# Altium project Trackpad.PrjPCB
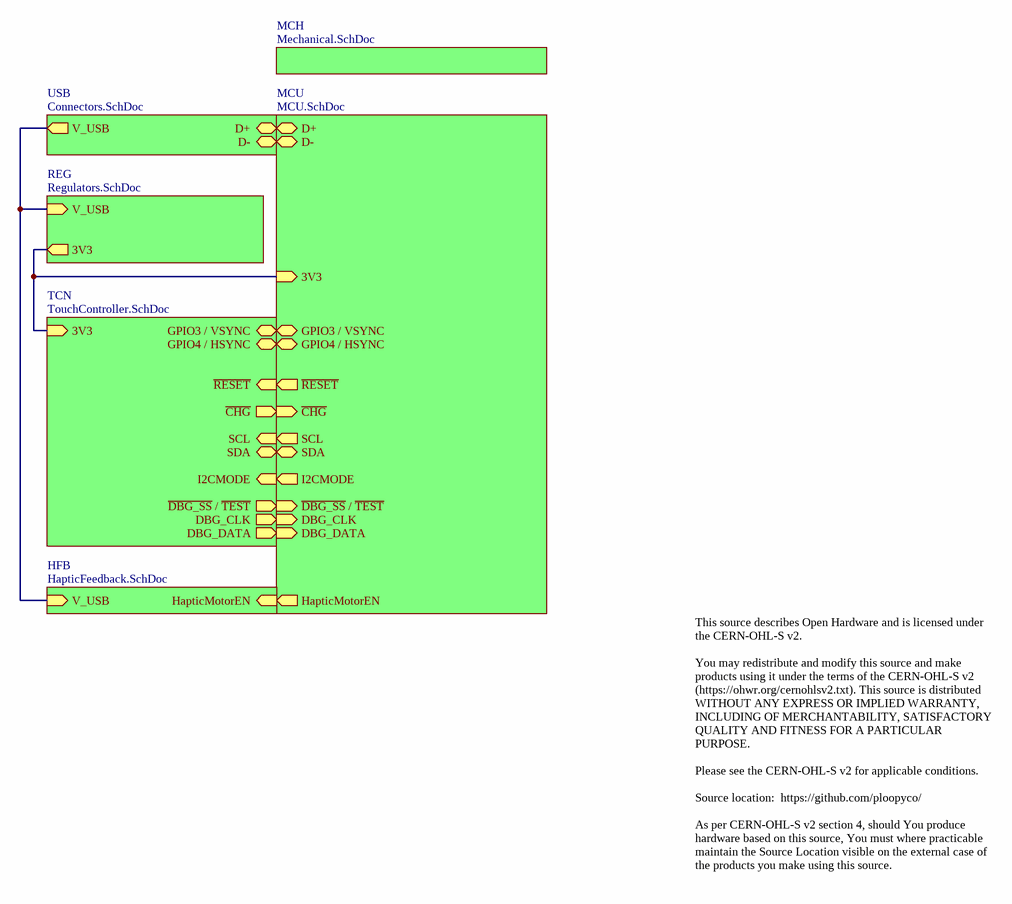
[diagram p0: Trackpad.SchDoc]
7 sheets, 124 parts. Net scope: hierarchical (ports join the sheet entries above them; power ports are global).
Board files: Trackpad.PcbDoc, TrackpadSolderStencil.PcbDoc, TrackpadPanel.PcbDoc
Sheets:
  Trackpad.SchDoc
    USB = Connectors.SchDoc
    REG = Regulators.SchDoc
    TCN = TouchController.SchDoc
    MCU = MCU.SchDoc
    MCH = Mechanical.SchDoc
    HFB = HapticFeedback.SchDoc

## Sheet Trackpad.SchDoc
size Letter; CompanyName: Ploopy Corporation; Organization: Ploopy Corporation; Address1: 137-1140 Burnhamthorpe Road W; Address2: Mississauga; Address3: Ontario; Address4: Canada L5C 0A3; DocumentNumber: 1; Revision: R2.002; SheetNumber: 1; SheetTotal: 8

### Sub-sheets
HFB = HapticFeedback.SchDoc: HapticMotorEN (in), V_USB (in)
MCH = Mechanical.SchDoc: no entries
MCU = MCU.SchDoc: D+ (bidir), D- (bidir), 3V3 (in), GPIO4 / HSYNC (bidir), GPIO3 / VSYNC (bidir), ~{RESET} (out), ~{CHG} (in), SCL (out), SDA (bidir), DBG_DATA (in), ~{DBG_SS} / ~{TEST} (in), DBG_CLK (in), I2CMODE (out), HapticMotorEN (out)
REG = Regulators.SchDoc: 3V3 (out), V_USB (in)
TCN = TouchController.SchDoc: 3V3 (in), DBG_DATA (out), GPIO4 / HSYNC (bidir), ~{RESET} (in), ~{DBG_SS} / ~{TEST} (out), DBG_CLK (out), GPIO3 / VSYNC (bidir), ~{CHG} (out), SCL (in), SDA (bidir), I2CMODE (in)
USB = Connectors.SchDoc: D+ (bidir), V_USB (out), D- (bidir)

### Nets
3V3: sheet REG/3V3, sheet TCN/3V3, sheet MCU/3V3
NetC35_2: sheet USB/V_USB, sheet REG/V_USB, sheet HFB/V_USB
NetQ1_G: sheet MCU/HapticMotorEN, sheet HFB/HapticMotorEN
NetR3_2: sheet USB/D-, sheet MCU/D-
NetR4_2: sheet USB/D+, sheet MCU/D+
NetRa1_3: sheet TCN/~{DBG_SS} / ~{TEST}, sheet MCU/~{DBG_SS} / ~{TEST}
NetRa1_4: sheet TCN/~{RESET}, sheet MCU/~{RESET}
NetRa2_1: sheet TCN/SDA, sheet MCU/SDA
NetRa2_2: sheet TCN/SCL, sheet MCU/SCL
NetRa2_3: sheet TCN/~{CHG}, sheet MCU/~{CHG}
NetU2_F7: sheet TCN/GPIO3 / VSYNC, sheet MCU/GPIO3 / VSYNC
NetU2_F8: sheet TCN/DBG_DATA, sheet MCU/DBG_DATA
NetU2_G8: sheet TCN/DBG_CLK, sheet MCU/DBG_CLK
NetU2_H6: sheet TCN/I2CMODE, sheet MCU/I2CMODE
NetU2_J8: sheet TCN/GPIO4 / HSYNC, sheet MCU/GPIO4 / HSYNC

### Notes on the sheet
- This source describes Open Hardware and is licensed under the CERN-OHL-S v2.
  You may redistribute and modify this source and make products using it under the terms of the CERN-OHL-S v2 (https://ohwr.org/cernohlsv2.txt). This source is distributed WITHOUT ANY EXPRESS OR IMPLIED WARRANTY, INCLUDING OF MERCHANTABILITY, SATISFACTORY QUALITY AND FITNESS FOR A PARTICULAR PURPOSE.
  Please see the CERN-OHL-S v2 for applicable conditions.
  Source location:  https://github.com/ploopyco/
  As per CERN-OHL-S v2 section 4, should You produce hardware based on this source, You must where practicable maintain the Source Location visible on the external case of the products you make using this source.
- Copyright Ploopy Corporation 2024
- Licensed under the CERN-OHL-S v2
- http://ohwr.org/cernohl
- Title:
- PCB:
- Version:
- Ploopy Corporation
- Mississauga ON L5C 0A3
- 137-1140 Burnhamthorpe Road W
- Date:
- Time:
- Sheet
- of
- Canada

## Sheet Connectors.SchDoc
size Letter; CompanyName: Ploopy Corporation; Organization: Ploopy Corporation; Address1: 137-1140 Burnhamthorpe Road W; Address2: Mississauga; Address3: Ontario; Address4: Canada L5C 0A3; DocumentNumber: 3; Revision: R2.002; SheetNumber: 3; SheetTotal: 8
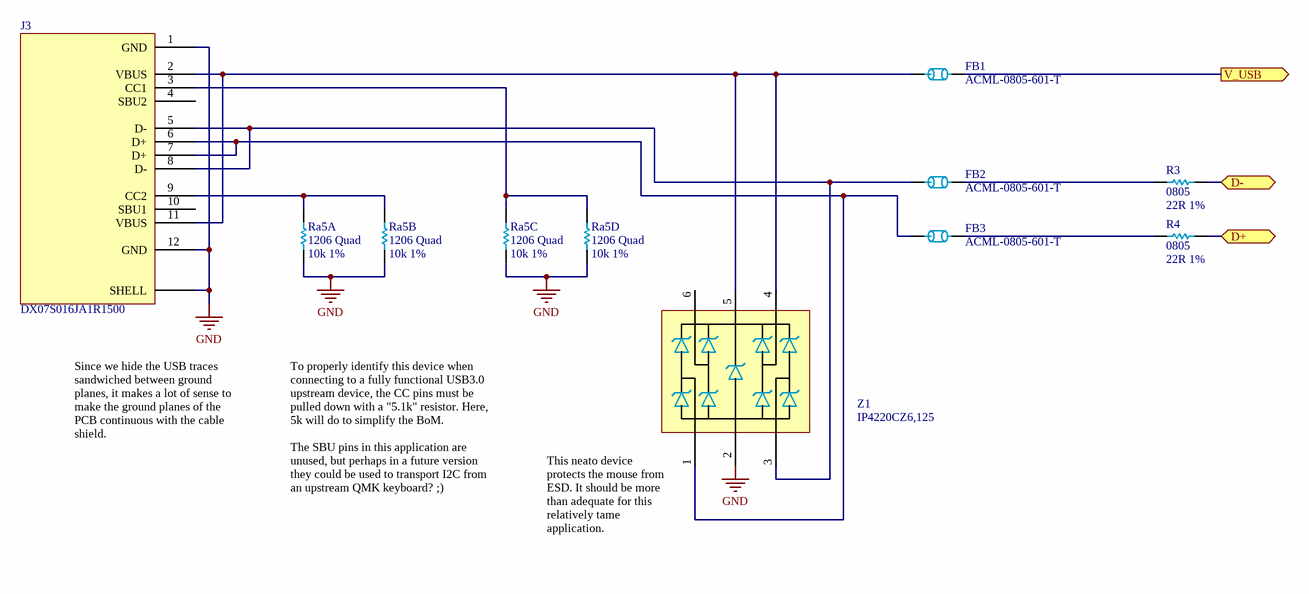
[diagram p1: Connectors.SchDoc]

### Parts
FB1  ACML-0805-601-T  [0805]
FB2  ACML-0805-601-T  [0805]
FB3  ACML-0805-601-T  [0805]
J3  DX07S016JA1R1500  [DX07S016JA1R1500]
R3  0805  value 22R 1%  [0805]
R4  0805  value 22R 1%  [0805]
Ra5  1206 Quad  value 10k 1%  [4x 10k 1% - CAC-80P320X160-8M]  (parts A,B,C,D of 4)
Z1  IP4220CZ6,125  [PESD3V3S4UD - SOT95P275X110-6N]

### Ports
D+ (bidir), D- (bidir), V_USB (out)

### Nets
GND: J3.1(GND) J3.12(GND) J3.SHELL Ra5.1 Ra5.2 Ra5.3 Ra5.4 Z1.2
NetC35_2: FB1.2 ; port V_USB
NetFB1_1: FB1.1 J3.2(VBUS) J3.11(VBUS) Z1.4 Z1.5
NetFB2_1: FB2.1 J3.5(D-) J3.8(D-) Z1.3
NetFB2_2: FB2.2 R3.1
NetFB3_1: FB3.1 J3.6(D+) J3.7(D+) Z1.1
NetFB3_2: FB3.2 R4.1
NetJ3_3: J3.3(CC1) Ra5.5 Ra5.6
NetJ3_9: J3.9(CC2) Ra5.7 Ra5.8
NetR3_2: R3.2 ; port D-
NetR4_2: R4.2 ; port D+

Not connected (* = marked no-connect by the designer): J3 4(SBU2) 10(SBU1); Z1 6

### Notes on the sheet
- Since we hide the USB traces sandwiched between ground planes, it makes a lot of sense to make the ground planes of the PCB continuous with the cable shield.
- To properly identify this device when connecting to a fully functional USB3.0 upstream device, the CC pins must be pulled down with a "5.1k" resistor. Here, 5k will do to simplify the BoM.
  The SBU pins in this application are unused, but perhaps in a future version they could be used to transport I2C from an upstream QMK keyboard? ;)
- (near Z1) This neato device protects the mouse from ESD. It should be more than adequate for this relatively tame application.
- Copyright Ploopy Corporation 2024
- Licensed under the CERN-OHL-S v2
- http://ohwr.org/cernohl
- Title:
- PCB:
- Version:
- Ploopy Corporation
- Mississauga ON L5C 0A3
- 137-1140 Burnhamthorpe Road W
- Date:
- Time:
- Sheet
- of
- Canada

### Library data of the parts
FB1-FB3 = ACML-0805-601-T: FERRITE BEAD 600 OHM 0805 1LN; PNP-Nzl: 2; PNP-dx: 0; PNP-X: 2.00; PNP-Y: 1.25; PNP-Thk: 0.55; PNP-Lv: 1; PNP-TS: 70; PNP-Type: chi; PNP-FeedType: Tape; PNP-TapeWidth: 8; PNP-dy: 0; PNP-Pt: 0; PNP-W: 0; PNP-Level: 1; PNP-Voff: 0; PNP-PlacePriority: 1; PNP-A: 0; PNP-TapeIndex: 1; PNP-da: 0; Supplier 1: Digi-Key; Supplier Part Number 1: 535-12556-1-ND
J3 = DX07S016JA1R1500: USB-C (USB TYPE-C) USB 2.0 Receptacle Connector 24 (16+8 Dummy) Position Surface Mount, Right Angle; Through Hole; Supplier 1: Digi-Key; Supplier 2: Mouser; Supplier Part Number 1: 670-DX07S016JA1R1500CT-ND; Supplier Part Number 2: 656-DX07S016JA1R1500
R3 R4 = Res 22R 1% 0805: Chip resistor; PNP-Nzl: 2; PNP-dx: 0; PNP-X: 2.00; PNP-Y: 1.25; PNP-Thk: 0.55; PNP-Lv: 1; PNP-TS: 70; PNP-Type: chi; PNP-FeedType: Tape; PNP-TapeWidth: 8; PNP-dy: 0; PNP-Pt: 0; PNP-W: 0; PNP-Level: 1; PNP-Voff: 0; PNP-PlacePriority: 1; PNP-A: 0; PNP-TapeIndex: 1; PNP-da: 0; Supplier 1: Digi-Key; Supplier 2: Arrow; Supplier Part Number 1: RMCF0805FT22R0CT-ND; Supplier Part Number 2: RMCF0805FT22R0
Ra5 = Quad Res 10k 1% 1206: Chip resistor
Z1 = IP4220CZ6,125: TVS DIODE 5.5V 6TSOP (Low capacitance, USB); PNP-Nzl: 2; PNP-dx: 0; PNP-X: 2.9; PNP-Y: 1.3; PNP-A: 270; PNP-Thk: 1; PNP-Lv: 26; PNP-TS: 90; PNP-Type: CHP; PNP-FeedType: Tape; PNP-TapeWidth: 8; PNP-PlacePriority: 3; PNP-dy: 0; PNP-Pt: 0; PNP-W: 0; PNP-Level: 1; PNP-Voff: 0; PNP-TapeIndex: 1; PNP-da: 0

## Sheet Regulators.SchDoc
size Letter; CompanyName: Ploopy Corporation; Organization: Ploopy Corporation; Address1: 137-1140 Burnhamthorpe Road W; Address2: Mississauga; Address3: Ontario; Address4: Canada L5C 0A3; DocumentNumber: 7; Revision: R2.002; SheetNumber: 7; SheetTotal: 8
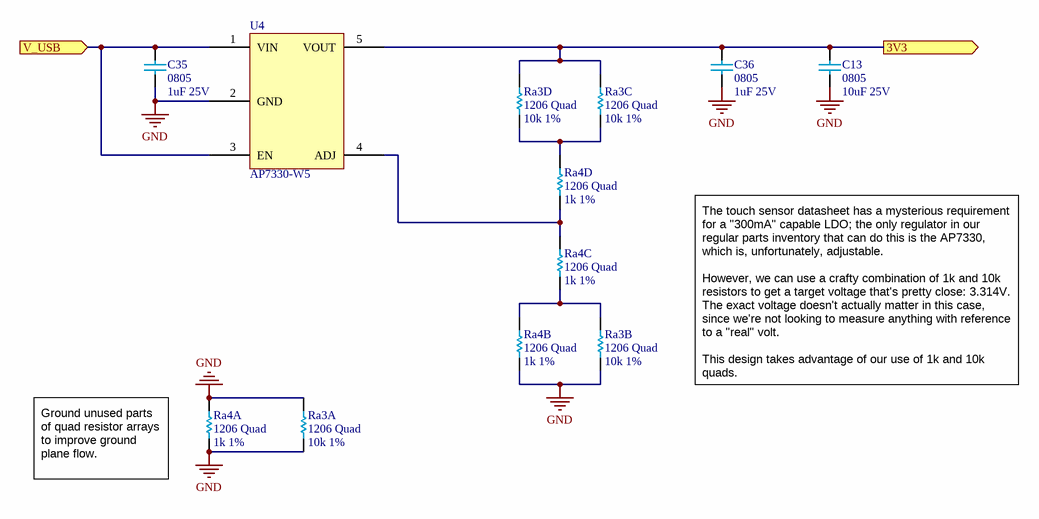
[diagram p2: Regulators.SchDoc]

### Parts
C13  0805  value 10uF 25V  [0805]
C35  0805  value 1uF 25V  [0805]
C36  0805  value 1uF 25V  [0805]
Ra3  1206 Quad  value 10k 1%  [4x 10k 1% - CAC-80P320X160-8M]  (parts A,B,C,D of 4)
Ra4  1206 Quad  value 1k 1%  [4x 1k 1% - CAC-80P320X160-8M]  (parts A,B,C,D of 4)
U4  AP7330-W5  [AP7330-W5 - SOT95P270X145-5N]

### Ports
3V3 (out), V_USB (in)

### Nets
GND: C13.1 C35.1 C36.1 Ra3.1 Ra3.2 Ra3.8 Ra4.1 Ra4.7 Ra4.8 U4.2(GND)
3V3: C13.2 C36.2 Ra3.3 Ra3.4 U4.5(VOUT) ; port 3V3
NetC35_2: C35.2 U4.1(VIN) U4.3(EN) ; port V_USB
NetRa3_5: Ra3.5 Ra3.6 Ra4.4
NetRa3_7: Ra3.7 Ra4.2 Ra4.3
NetRa4_5: Ra4.5 Ra4.6 U4.4(ADJ)

### Notes on the sheet
- The touch sensor datasheet has a mysterious requirement for a "300mA" capable LDO; the only regulator in our regular parts inventory that can do this is the AP7330, which is, unfortunately, adjustable.
  However, we can use a crafty combination of 1k and 10k resistors to get a target voltage that's pretty close: 3.314V. The exact voltage doesn't actually matter in this case, since we're not looking to measure anything with reference to a "real" volt.
  This design takes advantage of our use of 1k and 10k quads.
- (near Ra4) Ground unused parts of quad resistor arrays to improve ground plane flow.
- Copyright Ploopy Corporation 2024
- Licensed under the CERN-OHL-S v2
- http://ohwr.org/cernohl
- Title:
- PCB:
- Version:
- Ploopy Corporation
- Mississauga ON L5C 0A3
- 137-1140 Burnhamthorpe Road W
- Date:
- Time:
- Sheet
- of
- Canada

### Library data of the parts
C13 = Cap 10uF 25V: 0805, X5R or better; PNP-Nzl: 2; PNP-dx: 0; PNP-X: 2.00; PNP-Y: 1.25; PNP-Lv: 1; PNP-TS: 70; PNP-Type: chi; PNP-FeedType: Tape; PNP-TapeWidth: 8; PNP-dy: 0; PNP-Pt: 0; PNP-W: 0; PNP-Thk: 1.25; PNP-Level: 1; PNP-Voff: 0; PNP-PlacePriority: 1; PNP-A: 0; PNP-TapeIndex: 1; Supplier 1: Mouser; Supplier Part Number 1: 81-GRM21BR61E106KA3L; Supplier 2: Digi-Key; Supplier Part Number 2: 490-5523-1-ND; PNP-da: 0
C35 C36 = Cap 1uF 25V: 0805, X5R or better; PNP-Nzl: 2; PNP-dx: 0; PNP-Level: 1; PNP-Thk: 1.25; PNP-TS: 70; PNP-Type: chi; PNP-X: 2.00; PNP-FeedType: Tape; PNP-TapeWidth: 8; Supplier 1: Digi-Key; Supplier Part Number 1: 1276-1066-2-ND; Supplier 2: Digi-Key; Supplier Part Number 2: 1276-1066-1-ND; PNP-dy: 0; PNP-Lv: 1; PNP-Pt: 0; PNP-Voff: 0; PNP-W: 0; PNP-Y: 1.25; PNP-A: 0; PNP-PlacePriority: 1; PNP-TapeIndex: 1; PNP-da: 0
Ra3 = Quad Res 10k 1% 1206: Chip resistor
Ra4 = Quad Res 1k 1% 1206: Chip resistor
U4 = AP7330-W5: 300mA HIGH PSRR LOW NOISE LDO WITH ENABLE; Supplier 1: Digi-Key; Supplier Part Number 1: AP2202K-ADJTRG1DICT-ND; Supplier 2: Digi-Key; Supplier Part Number 2: 576-1262-1-ND

## Sheet TouchController.SchDoc
size Tabloid; CompanyName: Ploopy Corporation; Organization: Ploopy Corporation; Address1: 137-1140 Burnhamthorpe Road W; Address2: Mississauga; Address3: Ontario; Address4: Canada L5C 0A3; DocumentNumber: 8; Revision: R2.002; SheetNumber: 8; SheetTotal: 8
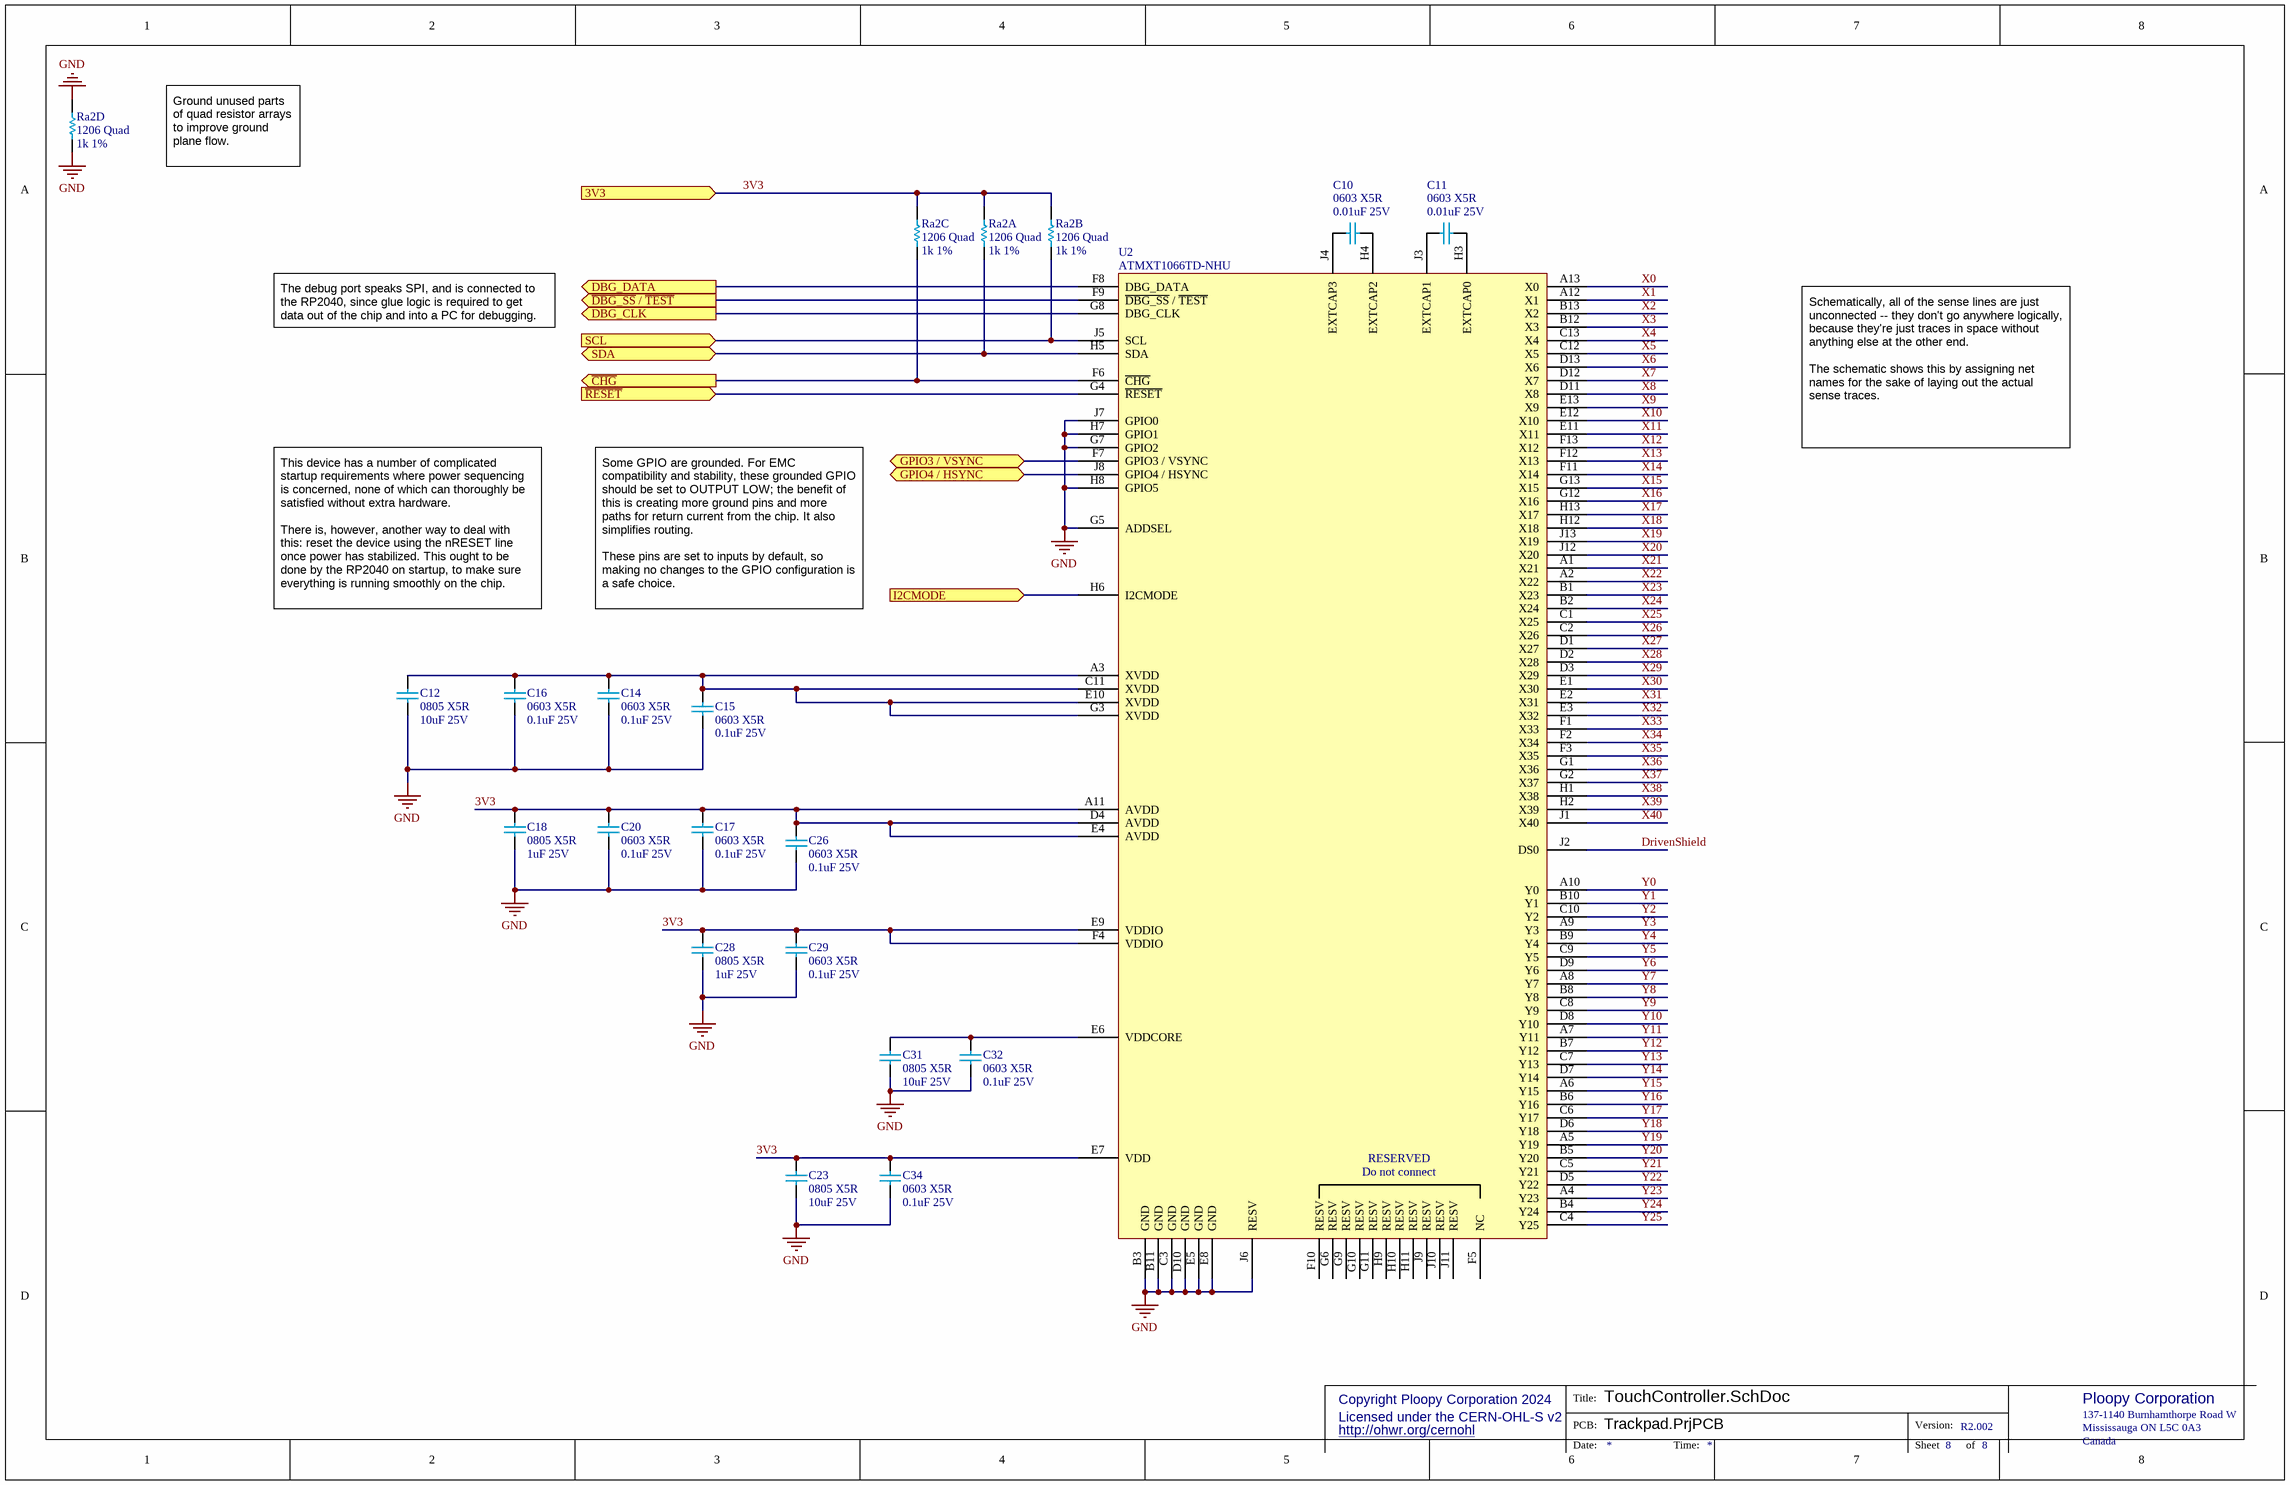
[diagram p3: TouchController.SchDoc]

### Parts
C10  0603 X5R  value 0.01uF 25V  [0603 capacitor - CAPC1608X06N]
C11  0603 X5R  value 0.01uF 25V  [0603 capacitor - CAPC1608X06N]
C12  0805 X5R  value 10uF 25V  [0805 - TALL]
C14  0603 X5R  value 0.1uF 25V  [0603 capacitor - CAPC1608X06N]
C15  0603 X5R  value 0.1uF 25V  [0603 capacitor - CAPC1608X06N]
C16  0603 X5R  value 0.1uF 25V  [0603 capacitor - CAPC1608X06N]
C17  0603 X5R  value 0.1uF 25V  [0603 capacitor - CAPC1608X06N]
C18  0805 X5R  value 1uF 25V  [0805 - TALL]
C20  0603 X5R  value 0.1uF 25V  [0603 capacitor - CAPC1608X06N]
C23  0805 X5R  value 10uF 25V  [0805 - TALL]
C26  0603 X5R  value 0.1uF 25V  [0603 capacitor - CAPC1608X06N]
C28  0805 X5R  value 1uF 25V  [0805 - TALL]
C29  0603 X5R  value 0.1uF 25V  [0603 capacitor - CAPC1608X06N]
C31  0805 X5R  value 10uF 25V  [0805 - TALL]
C32  0603 X5R  value 0.1uF 25V  [0603 capacitor - CAPC1608X06N]
C34  0603 X5R  value 0.1uF 25V  [0603 capacitor - CAPC1608X06N]
Ra2  1206 Quad  value 1k 1%  [4x 1k 1% - CAC-80P320X160-8M]  (parts A,B,C,D of 4)
U2  ATMXT1066TD-NHU  [ATMXT1066TD-NHU - BGA117C65P13X9_950X700X65]

### Ports
3V3 (in), DBG_CLK (out), DBG_DATA (out), GPIO3 / VSYNC (bidir), GPIO4 / HSYNC (bidir), I2CMODE (in), SCL (in), SDA (bidir), ~{CHG} (out), ~{DBG_SS} / ~{TEST} (out), ~{RESET} (in)

### Nets
GND: C12.1 C14.1 C15.1 C16.1 C17.1 C18.1 C20.1 C23.1 C26.1 C28.1 C29.1 C31.1 C32.1 C34.1 Ra2.4 Ra2.5 U2.B3(GND) U2.B11(GND) U2.C3(GND) U2.D10(GND) U2.E5(GND) U2.E8(GND) U2.G5(ADDSEL) U2.G7(GPIO2) U2.H7(GPIO1) U2.H8(GPIO5) U2.J6(RESV) U2.J7(GPIO0)
3V3: C17.2 C18.2 C20.2 C23.2 C26.2 C28.2 C29.2 C34.2 Ra2.6 Ra2.7 Ra2.8 U2.A11(AVDD) U2.D4(AVDD) U2.E4(AVDD) U2.E7(VDD) U2.E9(VDDIO) U2.F4(VDDIO) ; port 3V3
DrivenShield: U2.J2(DS0)
X0: U2.A13(X0)
X1: U2.A12(X1)
X2: U2.B13(X2)
X3: U2.B12(X3)
X4: U2.C13(X4)
X5: U2.C12(X5)
X6: U2.D13(X6)
X7: U2.D12(X7)
X8: U2.D11(X8)
X9: U2.E13(X9)
X10: U2.E12(X10)
X11: U2.E11(X11)
X12: U2.F13(X12)
X13: U2.F12(X13)
X14: U2.F11(X14)
X15: U2.G13(X15)
X16: U2.G12(X16)
X17: U2.H13(X17)
X18: U2.H12(X18)
X19: U2.J13(X19)
X20: U2.J12(X20)
X21: U2.A1(X21)
X22: U2.A2(X22)
X23: U2.B1(X23)
X24: U2.B2(X24)
X25: U2.C1(X25)
X26: U2.C2(X26)
X27: U2.D1(X27)
X28: U2.D2(X28)
X29: U2.D3(X29)
X30: U2.E1(X30)
X31: U2.E2(X31)
X32: U2.E3(X32)
X33: U2.F1(X33)
X34: U2.F2(X34)
X35: U2.F3(X35)
X36: U2.G1(X36)
X37: U2.G2(X37)
X38: U2.H1(X38)
X39: U2.H2(X39)
X40: U2.J1(X40)
Y0: U2.A10(Y0)
Y1: U2.B10(Y1)
Y2: U2.C10(Y2)
Y3: U2.A9(Y3)
Y4: U2.B9(Y4)
Y5: U2.C9(Y5)
Y6: U2.D9(Y6)
Y7: U2.A8(Y7)
Y8: U2.B8(Y8)
Y9: U2.C8(Y9)
Y10: U2.D8(Y10)
Y11: U2.A7(Y11)
Y12: U2.B7(Y12)
Y13: U2.C7(Y13)
Y14: U2.D7(Y14)
Y15: U2.A6(Y15)
Y16: U2.B6(Y16)
Y17: U2.C6(Y17)
Y18: U2.D6(Y18)
Y19: U2.A5(Y19)
Y20: U2.B5(Y20)
Y21: U2.C5(Y21)
Y22: U2.D5(Y22)
Y23: U2.A4(Y23)
Y24: U2.B4(Y24)
Y25: U2.C4(Y25)
NetC10_1: C10.1 U2.J4(EXTCAP3)
NetC10_2: C10.2 U2.H4(EXTCAP2)
NetC11_1: C11.1 U2.H3(EXTCAP0)
NetC11_2: C11.2 U2.J3(EXTCAP1)
NetC12_2: C12.2 C14.2 C15.2 C16.2 U2.A3(XVDD) U2.C11(XVDD) U2.E10(XVDD) U2.G3(XVDD)
NetC31_2: C31.2 C32.2 U2.E6(VDDCORE)
NetRa1_3: U2.F9(~{DBG_SS}_/_~{TEST}) ; port ~{DBG_SS} / ~{TEST}
NetRa1_4: U2.G4(~{RESET}) ; port ~{RESET}
NetRa2_1: Ra2.1 U2.H5(SDA) ; port SDA
NetRa2_2: Ra2.2 U2.J5(SCL) ; port SCL
NetRa2_3: Ra2.3 U2.F6(~{CHG}) ; port ~{CHG}
NetU2_F7: U2.F7(GPIO3_/_VSYNC) ; port GPIO3 / VSYNC
NetU2_F8: U2.F8(DBG_DATA) ; port DBG_DATA
NetU2_G8: U2.G8(DBG_CLK) ; port DBG_CLK
NetU2_H6: U2.H6(I2CMODE) ; port I2CMODE
NetU2_J8: U2.J8(GPIO4_/_HSYNC) ; port GPIO4 / HSYNC

Not connected (* = marked no-connect by the designer): U2 F5(NC) F10(RESV) G6(RESV) G9(RESV) G10(RESV) G11(RESV) H9(RESV) H10(RESV) H11(RESV) J9(RESV) J10(RESV) J11(RESV)

### Notes on the sheet
- Ground unused parts of quad resistor arrays to improve ground plane flow.
- The debug port speaks SPI, and is connected to the RP2040, since glue logic is required to get data out of the chip and into a PC for debugging.
- Schematically, all of the sense lines are just unconnected -- they don't go anywhere logically, because they're just traces in space without anything else at the other end.
  The schematic shows this by assigning net names for the sake of laying out the actual sense traces.
- This device has a number of complicated startup requirements where power sequencing is concerned, none of which can thoroughly be satisfied without extra hardware.
  There is, however, another way to deal with this: reset the device using the nRESET line once power has stabilized. This ought to be done by the RP2040 on startup, to make sure everything is running smoothly on the chip.
- Some GPIO are grounded. For EMC compatibility and stability, these grounded GPIO should be set to OUTPUT LOW; the benefit of this is creating more ground pins and more paths for return current from the chip. It also simplifies routing.
  These pins are set to inputs by default, so making no changes to the GPIO configuration is a safe choice.
- Copyright Ploopy Corporation 2024
- Licensed under the CERN-OHL-S v2
- http://ohwr.org/cernohl
- Title:
- PCB:
- Version:
- Ploopy Corporation
- Mississauga ON L5C 0A3
- 137-1140 Burnhamthorpe Road W
- Date:
- Time:
- Sheet
- of
- Canada
- (in symbol ATMXT1066TD-NHU) RESERVED; Do not connect

### Library data of the parts
C10 C11 = Cap 0.01uF 25V: 0603, X5R or better; Supplier 1: Digi-Key; Supplier Part Number 1: 1276-6840-2-ND
C12 C23 C31 = Cap 10uF 25V: 0805, X5R or better; Supplier 1: Mouser; Supplier Part Number 1: 81-GRM21BR61E106KA3L; Supplier 2: Digi-Key; Supplier Part Number 2: 490-5523-1-ND
C14-C17 C20 C26 C29 C32 C34 = Cap 0.1uF 25V: 0603, X5R or better; Supplier 1: Digi-Key; Supplier Part Number 1: 1276-6840-2-ND
C18 C28 = Cap 1uF 25V: 0805, X5R or better; Supplier 1: Digi-Key; Supplier Part Number 1: 1276-1066-2-ND; Supplier 2: Digi-Key; Supplier Part Number 2: 1276-1066-1-ND
Ra2 = Quad Res 1k 1% 1206: Chip resistor
U2 = ATMXT1066TD-NHU: maXTouch 1066-node Touchscreen Controller

## Sheet MCU.SchDoc
size Tabloid; CompanyName: Ploopy Corporation; Organization: Ploopy Corporation; Address1: 137-1140 Burnhamthorpe Road W; Address2: Mississauga; Address3: Ontario; Address4: Canada L5C 0A3; DocumentNumber: 5; Revision: R2.002; SheetNumber: 5; SheetTotal: 8
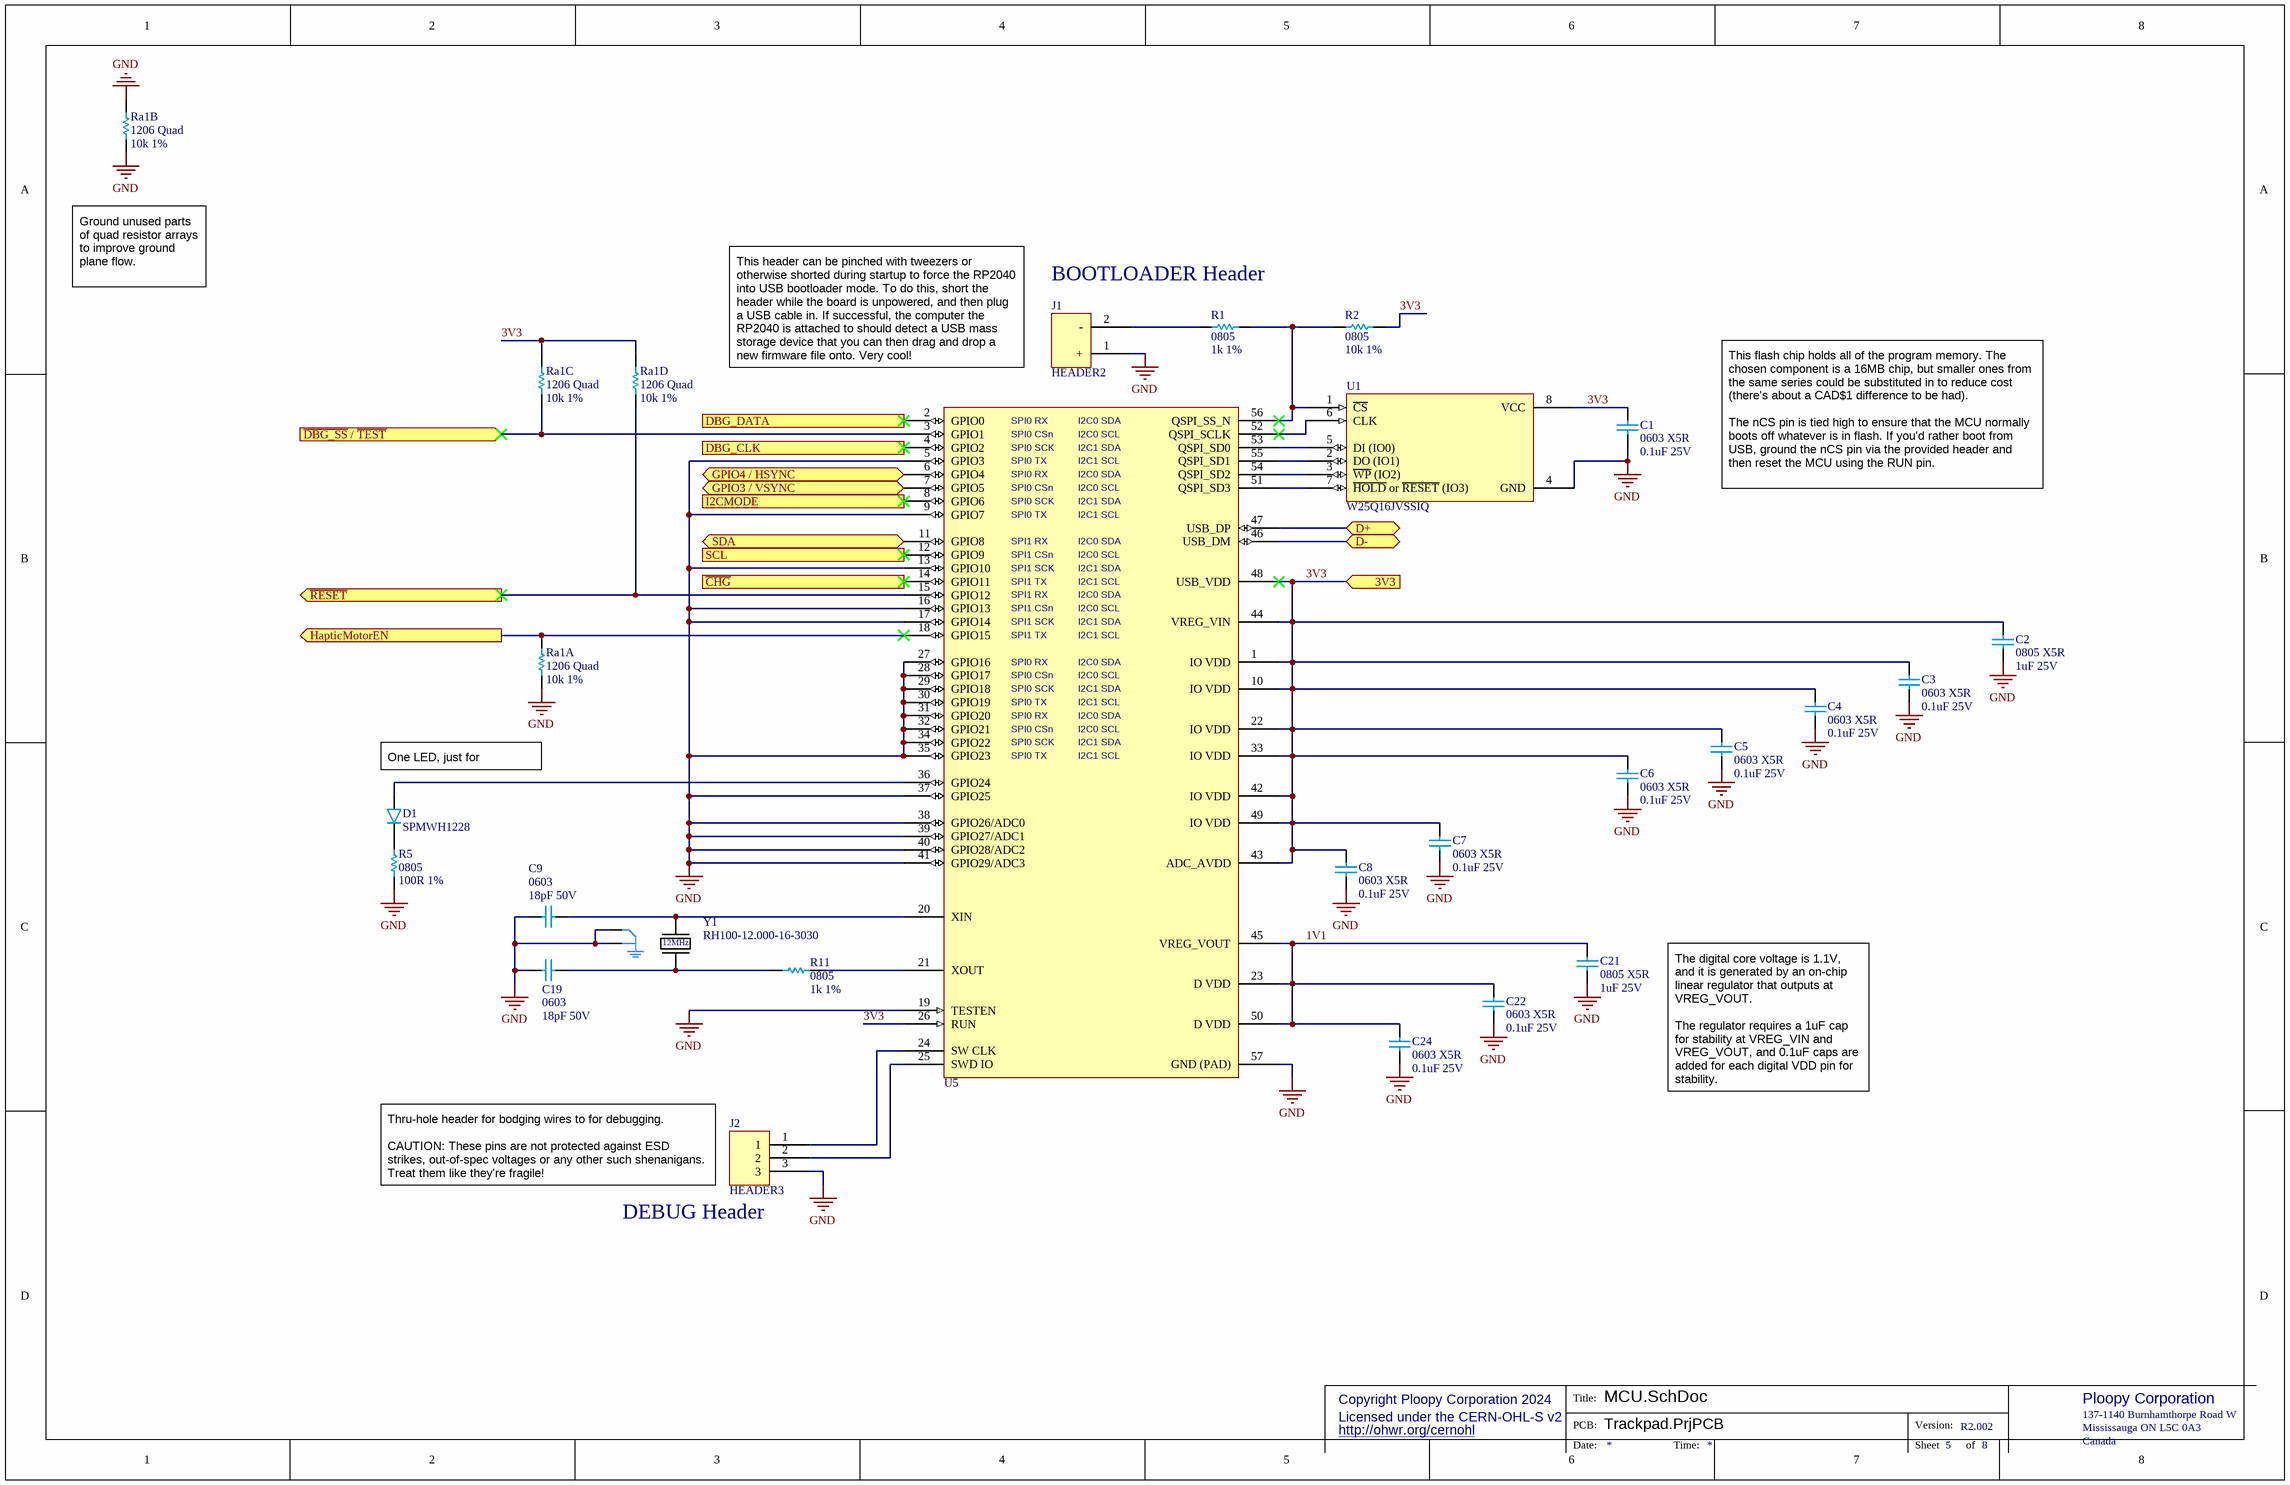
[diagram p4: MCU.SchDoc]

### Parts
C1  0603 X5R  value 0.1uF 25V  [0603 capacitor - CAPC1608X06N]
C2  0805 X5R  value 1uF 25V  [0805 - TALL]
C3  0603 X5R  value 0.1uF 25V  [0603 capacitor - CAPC1608X06N]
C4  0603 X5R  value 0.1uF 25V  [0603 capacitor - CAPC1608X06N]
C5  0603 X5R  value 0.1uF 25V  [0603 capacitor - CAPC1608X06N]
C6  0603 X5R  value 0.1uF 25V  [0603 capacitor - CAPC1608X06N]
C7  0603 X5R  value 0.1uF 25V  [0603 capacitor - CAPC1608X06N]
C8  0603 X5R  value 0.1uF 25V  [0603 capacitor - CAPC1608X06N]
C9  0603  value 18pF 50V  [0603 capacitor - CAPC1608X06N]
C19  0603  value 18pF 50V  [0603 capacitor - CAPC1608X06N]
C21  0805 X5R  value 1uF 25V  [0805 - TALL]
C22  0603 X5R  value 0.1uF 25V  [0603 capacitor - CAPC1608X06N]
C24  0603 X5R  value 0.1uF 25V  [0603 capacitor - CAPC1608X06N]
D1  SPMWH1228  [SPMWH1228]
J1  HEADER2  [2x1]
J2  HEADER3  [3x1]
R1  0805  value 1k 1%  [0805]
R2  0805  value 10k 1%  [0805]
R5  0805  value 100R 1%  [0805]
R11  0805  value 1k 1%  [0805]
Ra1  1206 Quad  value 10k 1%  [4x 10k 1% - CAC-80P320X160-8M]  (parts A,B,C,D of 4)
U1  W25Q16JVSSIQ  [W25Q128JVS - SOIC127P790X216-8M]
U5  RP2040  [RP2040 - QFN40P700X700X90_HS-57M]  (value not drawn)
Y1  RH100-12.000-16-3030  [RH100-12.000-16-3030]

### Ports
3V3 (in), D+ (bidir), D- (bidir), DBG_CLK (in), DBG_DATA (in), GPIO3 / VSYNC (bidir), GPIO4 / HSYNC (bidir), HapticMotorEN (out), I2CMODE (out), SCL (out), SDA (bidir), ~{CHG} (in), ~{DBG_SS} / ~{TEST} (in), ~{RESET} (out)

### Nets
GND: C1.1 C2.1 C3.1 C4.1 C5.1 C6.1 C7.1 C8.1 C9.2 C19.1 C21.1 C22.1 C24.1 J1.1(+) J2.3 R5.1 Ra1.2 Ra1.7 Ra1.8 U1.4(GND) U5.5(GPIO3) U5.9(GPIO7) U5.13(GPIO10) U5.16(GPIO13) U5.17(GPIO14) U5.19(TESTEN) U5.27(GPIO16) U5.28(GPIO17) U5.29(GPIO18) U5.30(GPIO19) U5.31(GPIO20) U5.32(GPIO21) U5.34(GPIO22) U5.35(GPIO23) U5.37(GPIO25) U5.38(GPIO26/ADC0) U5.39(GPIO27/ADC1) U5.40(GPIO28/ADC2) U5.41(GPIO29/ADC3) U5.57(GND_(PAD)) Y1.2 Y1.4
1V1: C21.2 C22.2 C24.2 U5.23(D_VDD) U5.45(VREG_VOUT) U5.50(D_VDD)
3V3: C1.2 C2.2 C3.2 C4.2 C5.2 C6.2 C7.2 C8.2 R2.1 Ra1.5 Ra1.6 U1.8(VCC) U5.1(IO_VDD) U5.10(IO_VDD) U5.22(IO_VDD) U5.26(RUN) U5.33(IO_VDD) U5.42(IO_VDD) U5.43(ADC_AVDD) U5.44(VREG_VIN) U5.48(USB_VDD) U5.49(IO_VDD) ; port 3V3
NetC9_1: C9.1 U5.20(XIN) Y1.1
NetC19_2: C19.2 R11.2 Y1.3
NetD1_1: D1.1(A) U5.36(GPIO24)
NetD1_2: D1.2(C) R5.2
NetJ1_2: J1.2(-) R1.1
NetJ2_1: J2.1 U5.24(SW_CLK)
NetJ2_2: J2.2 U5.25(SWD_IO)
NetQ1_G: Ra1.1 U5.18(GPIO15) ; port HapticMotorEN
NetR1_2: R1.2 R2.2 U1.1(~{CS}) U5.56(QSPI_SS_N)
NetR3_2: U5.46(USB_DM) ; port D-
NetR4_2: U5.47(USB_DP) ; port D+
NetR11_1: R11.1 U5.21(XOUT)
NetRa1_3: Ra1.3 U5.3(GPIO1) ; port ~{DBG_SS} / ~{TEST}
NetRa1_4: Ra1.4 U5.15(GPIO12) ; port ~{RESET}
NetRa2_1: U5.11(GPIO8) ; port SDA
NetRa2_2: U5.12(GPIO9) ; port SCL
NetRa2_3: U5.14(GPIO11) ; port ~{CHG}
NetU1_2: U1.2(DO_(IO1)) U5.55(QSPI_SD1)
NetU1_3: U1.3(~{WP}_(IO2)) U5.54(QSPI_SD2)
NetU1_5: U1.5(DI_(IO0)) U5.53(QSPI_SD0)
NetU1_6: U1.6(CLK) U5.52(QSPI_SCLK)
NetU1_7: U1.7(~{HOLD}_or_~{RESET}_(IO3)) U5.51(QSPI_SD3)
NetU2_F7: U5.7(GPIO5) ; port GPIO3 / VSYNC
NetU2_F8: U5.2(GPIO0) ; port DBG_DATA
NetU2_G8: U5.4(GPIO2) ; port DBG_CLK
NetU2_H6: U5.8(GPIO6) ; port I2CMODE
NetU2_J8: U5.6(GPIO4) ; port GPIO4 / HSYNC

### Notes on the sheet
- Ground unused parts of quad resistor arrays to improve ground plane flow.
- BOOTLOADER Header
- This header can be pinched with tweezers or otherwise shorted during startup to force the RP2040 into USB bootloader mode. To do this, short the header while the board is unpowered, and then plug a USB cable in. If successful, the computer the RP2040 is attached to should detect a USB mass storage device that you can then drag and drop a new firmware file onto. Very cool!
- This flash chip holds all of the program memory. The chosen component is a 16MB chip, but smaller ones from the same series could be substituted in to reduce cost (there's about a CAD$1 difference to be had).
  The nCS pin is tied high to ensure that the MCU normally boots off whatever is in flash. If you'd rather boot from USB, ground the nCS pin via the provided header and then reset the MCU using the RUN pin.
- (near D1) One LED, just for debugging.
- The digital core voltage is 1.1V, and it is generated by an on-chip linear regulator that outputs at VREG_VOUT.
  The regulator requires a 1uF cap for stability at VREG_VIN and VREG_VOUT, and 0.1uF caps are added for each digital VDD pin for stability.
- Thru-hole header for bodging wires to for debugging.
  CAUTION: These pins are not protected against ESD strikes, out-of-spec voltages or any other such shenanigans. Treat them like they're fragile!
- (near J2) DEBUG Header
- Copyright Ploopy Corporation 2024
- Licensed under the CERN-OHL-S v2
- http://ohwr.org/cernohl
- Title:
- PCB:
- Version:
- Ploopy Corporation
- Mississauga ON L5C 0A3
- 137-1140 Burnhamthorpe Road W
- Date:
- Time:
- Sheet
- of
- Canada
- (in symbol RH100-12.000-16-3030) 12MHz
- (in symbol RP2040) SPI0 RX; I2C0 SDA; SPI0 CSn; I2C0 SCL; SPI0 SCK; I2C1 SDA; SPI0 TX; I2C1 SCL; SPI1 RX; SPI1 CSn; SPI1 SCK; SPI1 TX

### Library data of the parts
C1 C3-C8 C22 C24 = Cap 0.1uF 25V: 0603, X5R or better; Supplier 1: Digi-Key; Supplier Part Number 1: 1276-6840-2-ND
C2 C21 = Cap 1uF 25V: 0805, X5R or better; Supplier 1: Digi-Key; Supplier Part Number 1: 1276-1066-2-ND; Supplier 2: Digi-Key; Supplier Part Number 2: 1276-1066-1-ND
C9 C19 = Cap 18pF 50V: 0603, C0G or better; Supplier 1: Digi-Key; Supplier Part Number 1: 1292-1494-1-ND
D1 = SPMWH1228: 3V/0.5W white LED, 2.8mm x 3.5mm; Supplier 2: Digi-Key; Supplier Part Number 2: 1510-1428-1-ND; Supplier 3: Digi-Key; Supplier Part Number 3: 1510-1429-1-ND; Supplier 1: Arrow
J1 = HEADER2: 2-pin 0.100" header; Supplier 1: Mouser; Supplier Part Number 1: 855-M20-9990245; Supplier 2: Digi-Key; Supplier Part Number 2: 952-2261-ND
J2 = HEADER3: 3-pin 0.100" header
R1 R11 = Res 1k 1% 0805: Chip resistor, 1/8W 100PPM; Supplier 1: Digi-Key; Supplier Part Number 1: RMCF0805FT1K00TR-ND
R2 = Res 10k 1% 0805: Chip resistor; Supplier 1: Digi-Key; Supplier Part Number 1: RMCF0805FT10K0TR-ND
R5 = Res 100R 1% 0805: Chip resistor; Supplier 1: Digi-Key; Supplier 2: Digi-Key; Supplier Part Number 1: RMCF0805FT100RCT-ND; Supplier Part Number 2: RMCF0805FT100RTR-ND
Ra1 = Quad Res 10k 1% 1206: Chip resistor
Y1 = RH100-12.000-16-3030: 12MHz Crystal 16pF 100 Ohms 4-SMD, No Lead (3.2mm x 2.5mm); Supplier 1: Digi-Key; Supplier 2: Mouser; Supplier Part Number 1: XC2686CT-ND; Supplier Part Number 2: 520-160-12-30B-AGMT
U1 = W25Q16JVSSIQ: Supplier 1: Digi-Key; Supplier Part Number 1: W25Q16JVSSIQ-ND
U5 = RP2040: Supplier 1: Newark; Supplier Part Number 1: 49AJ8740

## Sheet Mechanical.SchDoc
size Letter; CompanyName: Ploopy Corporation; Organization: Ploopy Corporation; Address1: 137-1140 Burnhamthorpe Road W; Address2: Mississauga; Address3: Ontario; Address4: Canada L5C 0A3; DocumentNumber: 6; Revision: R2.002; SheetNumber: 6; SheetTotal: 8
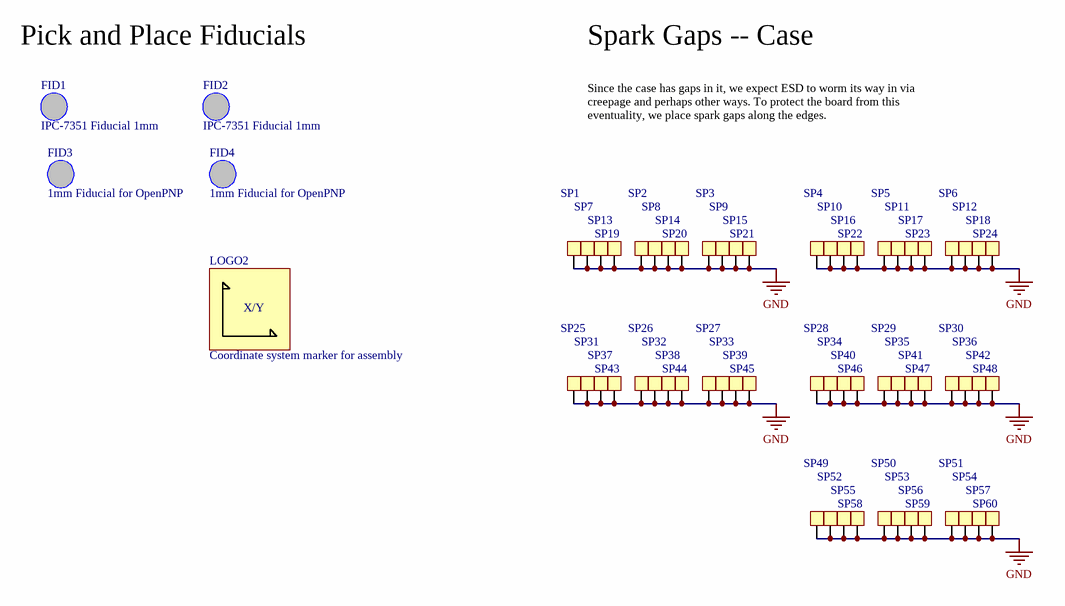
[diagram p5: Mechanical.SchDoc]

### Parts
FID1  IPC-7351 Fiducial 1mm  [FIDUCIAL_1.5]
FID2  IPC-7351 Fiducial 1mm  [FIDUCIAL_1.5]
FID3  1mm Fiducial for OpenPNP  [FIDUCIAL-NEW]
FID4  1mm Fiducial for OpenPNP  [FIDUCIAL-NEW]
LOGO2  Coordinate system marker for assembly  [Coordinate System]  (no BOM)
SP1  Spark Gap  [SparkGap]  (value not drawn)  (no BOM)
SP2  Spark Gap  [SparkGap]  (value not drawn)  (no BOM)
SP3  Spark Gap  [SparkGap]  (value not drawn)  (no BOM)
SP4  Spark Gap  [SparkGap]  (value not drawn)  (no BOM)
SP5  Spark Gap  [SparkGap]  (value not drawn)  (no BOM)
SP6  Spark Gap  [SparkGap]  (value not drawn)  (no BOM)
SP7  Spark Gap  [SparkGap]  (value not drawn)  (no BOM)
SP8  Spark Gap  [SparkGap]  (value not drawn)  (no BOM)
SP9  Spark Gap  [SparkGap]  (value not drawn)  (no BOM)
SP10  Spark Gap  [SparkGap]  (value not drawn)  (no BOM)
SP11  Spark Gap  [SparkGap]  (value not drawn)  (no BOM)
SP12  Spark Gap  [SparkGap]  (value not drawn)  (no BOM)
SP13  Spark Gap  [SparkGap]  (value not drawn)  (no BOM)
SP14  Spark Gap  [SparkGap]  (value not drawn)  (no BOM)
SP15  Spark Gap  [SparkGap]  (value not drawn)  (no BOM)
SP16  Spark Gap  [SparkGap]  (value not drawn)  (no BOM)
SP17  Spark Gap  [SparkGap]  (value not drawn)  (no BOM)
SP18  Spark Gap  [SparkGap]  (value not drawn)  (no BOM)
SP19  Spark Gap  [SparkGap]  (value not drawn)  (no BOM)
SP20  Spark Gap  [SparkGap]  (value not drawn)  (no BOM)
SP21  Spark Gap  [SparkGap]  (value not drawn)  (no BOM)
SP22  Spark Gap  [SparkGap]  (value not drawn)  (no BOM)
SP23  Spark Gap  [SparkGap]  (value not drawn)  (no BOM)
SP24  Spark Gap  [SparkGap]  (value not drawn)  (no BOM)
SP25  Spark Gap  [SparkGap]  (value not drawn)  (no BOM)
SP26  Spark Gap  [SparkGap]  (value not drawn)  (no BOM)
SP27  Spark Gap  [SparkGap]  (value not drawn)  (no BOM)
SP28  Spark Gap  [SparkGap]  (value not drawn)  (no BOM)
SP29  Spark Gap  [SparkGap]  (value not drawn)  (no BOM)
SP30  Spark Gap  [SparkGap]  (value not drawn)  (no BOM)
SP31  Spark Gap  [SparkGap]  (value not drawn)  (no BOM)
SP32  Spark Gap  [SparkGap]  (value not drawn)  (no BOM)
SP33  Spark Gap  [SparkGap]  (value not drawn)  (no BOM)
SP34  Spark Gap  [SparkGap]  (value not drawn)  (no BOM)
SP35  Spark Gap  [SparkGap]  (value not drawn)  (no BOM)
SP36  Spark Gap  [SparkGap]  (value not drawn)  (no BOM)
SP37  Spark Gap  [SparkGap]  (value not drawn)  (no BOM)
SP38  Spark Gap  [SparkGap]  (value not drawn)  (no BOM)
SP39  Spark Gap  [SparkGap]  (value not drawn)  (no BOM)
SP40  Spark Gap  [SparkGap]  (value not drawn)  (no BOM)
SP41  Spark Gap  [SparkGap]  (value not drawn)  (no BOM)
SP42  Spark Gap  [SparkGap]  (value not drawn)  (no BOM)
SP43  Spark Gap  [SparkGap]  (value not drawn)  (no BOM)
SP44  Spark Gap  [SparkGap]  (value not drawn)  (no BOM)
SP45  Spark Gap  [SparkGap]  (value not drawn)  (no BOM)
SP46  Spark Gap  [SparkGap]  (value not drawn)  (no BOM)
SP47  Spark Gap  [SparkGap]  (value not drawn)  (no BOM)
SP48  Spark Gap  [SparkGap]  (value not drawn)  (no BOM)
SP49  Spark Gap  [SparkGap]  (value not drawn)  (no BOM)
SP50  Spark Gap  [SparkGap]  (value not drawn)  (no BOM)
SP51  Spark Gap  [SparkGap]  (value not drawn)  (no BOM)
SP52  Spark Gap  [SparkGap]  (value not drawn)  (no BOM)
SP53  Spark Gap  [SparkGap]  (value not drawn)  (no BOM)
SP54  Spark Gap  [SparkGap]  (value not drawn)  (no BOM)
SP55  Spark Gap  [SparkGap]  (value not drawn)  (no BOM)
SP56  Spark Gap  [SparkGap]  (value not drawn)  (no BOM)
SP57  Spark Gap  [SparkGap]  (value not drawn)  (no BOM)
SP58  Spark Gap  [SparkGap]  (value not drawn)  (no BOM)
SP59  Spark Gap  [SparkGap]  (value not drawn)  (no BOM)
SP60  Spark Gap  [SparkGap]  (value not drawn)  (no BOM)

### Nets
GND: SP1.1 SP2.1 SP3.1 SP4.1 SP5.1 SP6.1 SP7.1 SP8.1 SP9.1 SP10.1 SP11.1 SP12.1 SP13.1 SP14.1 SP15.1 SP16.1 SP17.1 SP18.1 SP19.1 SP20.1 SP21.1 SP22.1 SP23.1 SP24.1 SP25.1 SP26.1 SP27.1 SP28.1 SP29.1 SP30.1 SP31.1 SP32.1 SP33.1 SP34.1 SP35.1 SP36.1 SP37.1 SP38.1 SP39.1 SP40.1 SP41.1 SP42.1 SP43.1 SP44.1 SP45.1 SP46.1 SP47.1 SP48.1 SP49.1 SP50.1 SP51.1 SP52.1 SP53.1 SP54.1 SP55.1 SP56.1 SP57.1 SP58.1 SP59.1 SP60.1

Not connected (* = marked no-connect by the designer): FID1 1; FID2 1; FID3 1; FID4 1

### Notes on the sheet
- Pick and Place Fiducials
- Spark Gaps -- Case
- Since the case has gaps in it, we expect ESD to worm its way in via creepage and perhaps other ways. To protect the board from this eventuality, we place spark gaps along the edges.
- Copyright Ploopy Corporation 2024
- Licensed under the CERN-OHL-S v2
- http://ohwr.org/cernohl
- Title:
- PCB:
- Version:
- Ploopy Corporation
- Mississauga ON L5C 0A3
- 137-1140 Burnhamthorpe Road W
- Date:
- Time:
- Sheet
- of
- Canada
- (in symbol CoordinateSystem) X/Y

### Library data of the parts
FID1 FID2 = FIDUCIAL_1.5: PNP-Nzl: 2; PNP-dx: 0; PNP-X: 4; PNP-A: 1; PNP-Thk: 1.02; PNP-TS: 70; PNP-Type: MARK1; PNP-dy: 0; PNP-Y: 4; PNP-Pt: 0; PNP-W: 0; PNP-Lv: 1; PNP-Level: 1; PNP-Voff: 0; PNP-FeedType: Fiducial; PNP-TapeWidth: 0; PNP-PlacePriority: 0; PNP-TapeIndex: 0; PNP-da: 0
FID3 FID4 = FIDUCIAL_NEW: This fiducial is designed to work with OpenPNP. It presents a circular pattern under the solder mask, to prevent glare issues from messing with the detection.; PNP-Nzl: 2; PNP-dx: 0; PNP-X: 4; PNP-A: 1; PNP-Thk: 1.02; PNP-TS: 70; PNP-Type: MARK1; PNP-dy: 0; PNP-Y: 4; PNP-Pt: 0; PNP-W: 0; PNP-Lv: 1; PNP-Level: 1; PNP-Voff: 0; PNP-FeedType: Fiducial; PNP-TapeWidth: 0; PNP-PlacePriority: 0; PNP-TapeIndex: 0; PNP-da: 0
LOGO2 = CoordinateSystem
SP1-SP60 = Spark Gap: Open square pad for spark gapping; PNP-Nzl: 2; PNP-dx: 0; PNP-X: 1; PNP-TS: 70; PNP-Type: CHI; PNP-FeedType: Tape; PNP-TapeWidth: 8; PNP-dy: 0; PNP-Y: 1; PNP-A: 0; PNP-Pt: 0; PNP-W: 0; PNP-Thk: 1; PNP-Lv: 1; PNP-Level: 1; PNP-Voff: 0; PNP-PlacePriority: 1; PNP-TapeIndex: 1; PNP-da: 0

## Sheet HapticFeedback.SchDoc
size Letter; CompanyName: Ploopy Corporation; Organization: Ploopy Corporation; Address1: Suite 226, 137-1140 Burnhamthorpe Road W; Address2: Mississauga; Address3: Ontario; Address4: Canada L5C 0A3; DocumentNumber: 4; Revision: R2.002; SheetNumber: 4; SheetTotal: 8
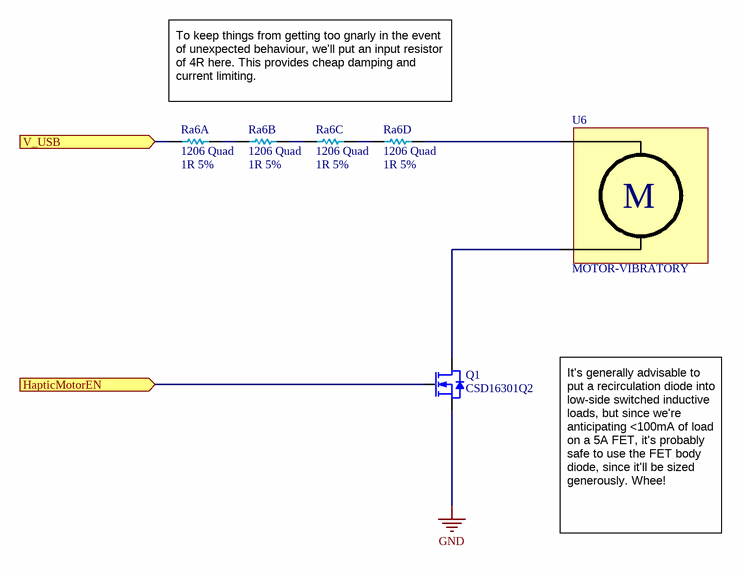
[diagram p6: HapticFeedback.SchDoc]

### Parts
Q1  CSD16301Q2  [CSD16301Q2 - SON65P200X80_HS-7M]
Ra6  1206 Quad  value 1R 5%  [4x 1R 5% - CAC-80P320X160-8M]  (parts A,B,C,D of 4)
U6  MOTOR-VIBRATORY  [MOTOR-VIBRATORY]

### Ports
HapticMotorEN (in), V_USB (in)

### Nets
GND: Q1.S
NetC35_2: Ra6.1 ; port V_USB
NetQ1_D: Q1.D U6.2
NetQ1_G: Q1.G ; port HapticMotorEN
NetRa6_2: Ra6.2 Ra6.8
NetRa6_3: Ra6.3 Ra6.7
NetRa6_4: Ra6.4 Ra6.6
NetRa6_5: Ra6.5 U6.1

### Notes on the sheet
- (near Ra6) To keep things from getting too gnarly in the event of unexpected behaviour, we'll put an input resistor of 4R here. This provides cheap damping and current limiting.
- It's generally advisable to put a recirculation diode into low-side switched inductive loads, but since we're anticipating <100mA of load on a 5A FET, it's probably safe to use the FET body diode, since it'll be sized generously. Whee!
- Copyright Ploopy Corporation 2024
- Licensed under the CERN-OHL-S v2
- http://ohwr.org/cernohl
- Title:
- PCB:
- Version:
- Ploopy Corporation
- Mississauga ON L5C 0A3
- 137-1140 Burnhamthorpe Road W
- Date:
- Time:
- Sheet
- of
- Canada
- (in symbol MOTOR-VIBRATORY) M

### Library data of the parts
Q1 = CSD16301Q2: 25-V N-Channel Power MOSFET, 20mOhm, 2nC Qg
Ra6 = Quad Res 1R 5% 1206: Chip resistor
U6 = MOTOR-VIBRATORY: A sort of bargain basement miscellaneous kind of vibration motor that can be found on AliExpress. It has springs for connecting directly to a PCB.

## Nets that join several sheets
GND: Connectors (8 pins), Regulators (10 pins), TouchController (28 pins), MCU (42 pins), Mechanical (60 pins), HapticFeedback (Q1.S)
3V3: Regulators (5 pins), TouchController (17 pins), MCU (22 pins)
NetC35_2: Connectors (FB1.2), Regulators (C35.2 U4.1 U4.3), HapticFeedback (Ra6.1)
NetQ1_G: MCU (Ra1.1 U5.18), HapticFeedback (Q1.G)
NetR3_2: Connectors (R3.2), MCU (U5.46)
NetR4_2: Connectors (R4.2), MCU (U5.47)
NetRa1_3: TouchController (U2.F9), MCU (Ra1.3 U5.3)
NetRa1_4: TouchController (U2.G4), MCU (Ra1.4 U5.15)
NetRa2_1: TouchController (Ra2.1 U2.H5), MCU (U5.11)
NetRa2_2: TouchController (Ra2.2 U2.J5), MCU (U5.12)
NetRa2_3: TouchController (Ra2.3 U2.F6), MCU (U5.14)
NetU2_F7: TouchController (U2.F7), MCU (U5.7)
NetU2_F8: TouchController (U2.F8), MCU (U5.2)
NetU2_G8: TouchController (U2.G8), MCU (U5.4)
NetU2_H6: TouchController (U2.H6), MCU (U5.8)
NetU2_J8: TouchController (U2.J8), MCU (U5.6)